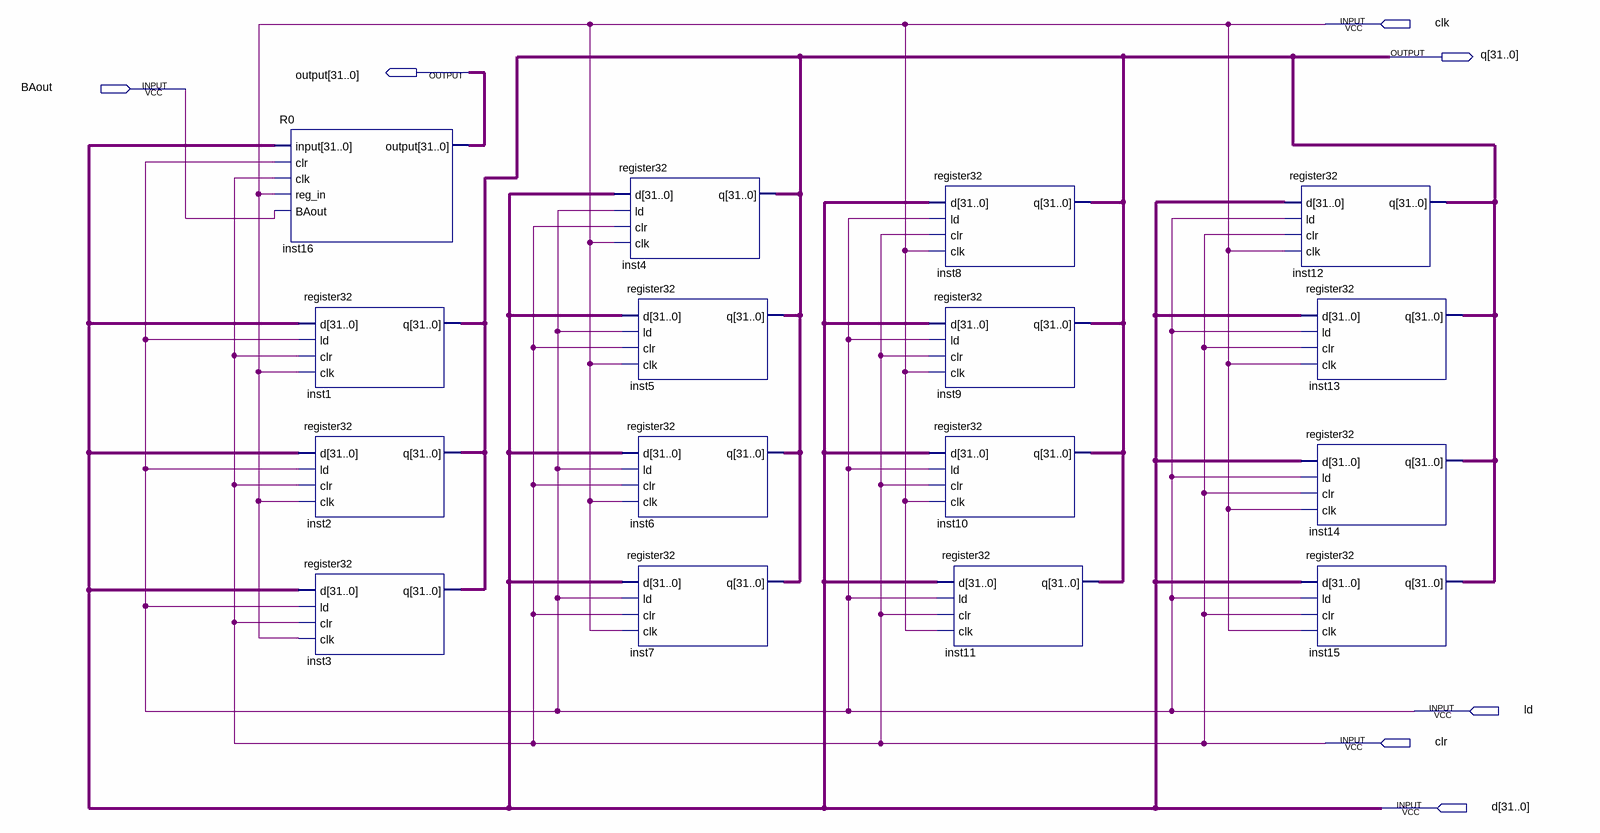
[diagram p0: schematic sheet]
// Quartus schematic RegisterBlockPhase2.bdf as structural Verilog: 16 symbols, 7 pins
module RegisterBlockPhase2 (
  input  clk,
  input  BAout,
  input  ld,
  input  clr,
  input  [31:0] d,
  output [31:0] q,
  output [31:0] \output 
);

  R0 inst16 (.\input (d), .clr(ld), .clk(clr), .reg_in(clk), .BAout(BAout), .\output (\output ));
  register32 inst1 (.d(d), .ld(ld), .clr(clr), .clk(clk), .q(q));
  register32 inst2 (.d(d), .ld(ld), .clr(clr), .clk(clk), .q(q));
  register32 inst3 (.d(d), .ld(ld), .clr(clr), .clk(clk), .q(q));
  register32 inst4 (.d(d), .ld(ld), .clr(clr), .clk(clk), .q(q));
  register32 inst5 (.d(d), .ld(ld), .clr(clr), .clk(clk), .q(q));
  register32 inst6 (.d(d), .ld(ld), .clr(clr), .clk(clk), .q(q));
  register32 inst7 (.d(d), .ld(ld), .clr(clr), .clk(clk), .q(q));
  register32 inst8 (.d(d), .ld(ld), .clr(clr), .clk(clk), .q(q));
  register32 inst9 (.d(d), .ld(ld), .clr(clr), .clk(clk), .q(q));
  register32 inst10 (.d(d), .ld(ld), .clr(clr), .clk(clk), .q(q));
  register32 inst11 (.d(d), .ld(ld), .clr(clr), .clk(clk), .q(q));
  register32 inst12 (.d(d), .ld(ld), .clr(clr), .clk(clk), .q(q));
  register32 inst13 (.d(d), .ld(ld), .clr(clr), .clk(clk), .q(q));
  register32 inst14 (.d(d), .ld(ld), .clr(clr), .clk(clk), .q(q));
  register32 inst15 (.d(d), .ld(ld), .clr(clr), .clk(clk), .q(q));
endmodule
